# Altium project LM-004-A.PrjPcb
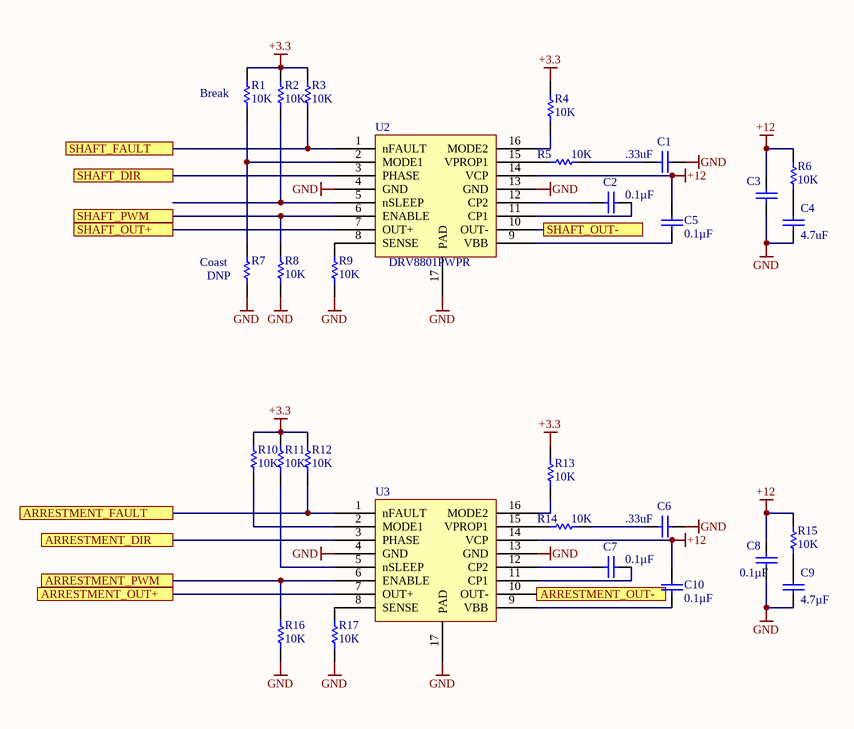
[diagram p0: DC-Motor-DRV.SchDoc]
4 sheets, 50 parts. Net scope: flat (ports and power ports of the same name join across sheets).
Board file: LM-004-B.PcbDoc
Sheets:
  DC-Motor-DRV.SchDoc
  Encoder.SchDoc
  BBB_Connections.SchDoc
  Bluetooth.SchDoc

## Sheet DC-Motor-DRV.SchDoc: DC Motor Driver
size OrCAD A; DocumentNumber: LM-004; Revision: B; SheetNumber: 1; SheetTotal: 4

### Parts
(Parts that share a designator on the sheet are numbered #1, #2 ... from top to bottom, then left to right.)
C1  .33uF  [CAPC0805(2012)145_N]
C2  Capacitance: 0.1µF  [CAPC0805(2012)145_N]  (hidden comment: 0.1uF)
C3  0.1uF  [CAPC0805(2012)145_N]  (value not drawn)
C4  4.7uF  [CAPC0805(2012)145_N]
C5  Capacitance: 0.1µF  [CAPC0805(2012)145_N]  (hidden comment: 0.1uF)
C6  .33uF  [CAPC0805(2012)145_N]
C7  Capacitance: 0.1µF  [CAPC0805(2012)145_N]  (hidden comment: CAP CER 0.1UF 25V X7R 0805)
C8  Capacitance: 0.1µF  [CAPC0805(2012)145_N]  (hidden comment: CAP CER 0.1UF 25V X7R 0805)
C9  Capacitance: 4.7µF  [CAPC0805(2012)145_N]  (hidden comment: CAP CER 0.1UF 25V X7R 0805)
C10  Capacitance: 0.1µF  [CAPC0805(2012)145_N]  (hidden comment: CAP CER 0.1UF 25V X7R 0805)
R1#1  10K  [RESC0805(2012)_L]
R2#1  10K  [RESC0805(2012)_L]
R3#1  10K  [RESC0805(2012)_L]
R4#1  10K  [RESC0805(2012)_L]
R5#1  10K  [RESC0805(2012)_L]
R6#1  10K  [RESC0805(2012)_L]
R7  DNP  [RESC0805(2012)_L]
R8  10K  [RESC0805(2012)_L]
R9  10K  [RESC0805(2012)_L]
R10  10K  [RESC0805(2012)_L]
R11  10K  [RESC0805(2012)_L]
R12  10K  [RESC0805(2012)_L]
R13  10K  [RESC0805(2012)_L]
R14  10K  [RESC0805(2012)_L]
R15  10K  [RESC0805(2012)_L]
R16  10K  [RESC0805(2012)_L]
R17  10K  [RESC0805(2012)_L]
U2  DRV8801PWPR  [DRV8801PWPR]
U3  DRV8801PWPR  [DRV8801PWPR]  (value not drawn)

### Ports
ARRESTMENT_DIR, ARRESTMENT_FAULT, ARRESTMENT_OUT+, ARRESTMENT_OUT-, ARRESTMENT_PWM, SHAFT_DIR, SHAFT_FAULT, SHAFT_OUT+, SHAFT_OUT-, SHAFT_PWM

### Nets
+3.3: R1#1.1 R2#1.1 R3#1.1 R4#1.1 R10.1 R11.1 R12.1 R13.1
+12: C3.1 C5.2 C8.1 C10.2 R6#1.1 R15.1 U2.14(VCP) U3.14(VCP)
GND: C1.1 C3.2 C4.2 C6.1 C8.2 C9.2 R7.2 R8.2 R9.2 R16.2 R17.2 U2.4(GND) U2.13(GND) U2.17(PAD) U3.4(GND) U3.13(GND) U3.17(PAD)
NetC1_2: C1.2 R5#1.1
NetC2_1: C2.1 U2.12(CP2)
NetC2_2: C2.2 U2.11(CP1)
NetC4_1: C4.1 R6#1.2
NetC5_1: C5.1 U2.9(VBB)
NetC6_2: C6.2 R14.1
NetC7_1: C7.1 U3.12(CP2)
NetC7_2: C7.2 U3.11(CP1)
NetC9_1: C9.1 R15.2
NetC10_1: C10.1 U3.9(VBB)
NetR1#1_2: R1#1.2 R7.1 U2.2(MODE1)
NetR2#1_2: R2#1.2 U2.5(nSLEEP)
NetR3#1_2: R3#1.2 U2.1(nFAULT) ; port SHAFT_FAULT
NetR4#1_2: R4#1.2 U2.16(MODE2)
NetR5#1_2: R5#1.2 U2.15(VPROP1)
NetR8_1: R8.1 U2.6(ENABLE) ; port SHAFT_PWM
NetR9_1: R9.1 U2.8(SENSE)
NetR10_2: R10.2 U3.2(MODE1)
NetR11_2: R11.2 U3.5(nSLEEP)
NetR12_2: R12.2 U3.1(nFAULT) ; port ARRESTMENT_FAULT
NetR13_2: R13.2 U3.16(MODE2)
NetR14_2: R14.2 U3.15(VPROP1)
NetR16_1: R16.1 U3.6(ENABLE) ; port ARRESTMENT_PWM
NetR17_1: R17.1 U3.8(SENSE)
NetU1_8-11: U2.3(PHASE) ; port SHAFT_DIR
NetU1_8-17: U3.3(PHASE) ; port ARRESTMENT_DIR
NetU2_7: U2.7(OUT+) ; port SHAFT_OUT+
NetU2_10: U2.10(OUT-) ; port SHAFT_OUT-
NetU3_7: U3.7(OUT+) ; port ARRESTMENT_OUT+
NetU3_10: U3.10(OUT-) ; port ARRESTMENT_OUT-

### Notes on the sheet
- (near R1#1) Break
- (near R7) Coast
- Title
- Size:
- Date:
- Orcad A
- Number:
- Time:
- Revision:
- Sheet
- of
- ZLS Corporation
- 7801 North Lamar Blvd.
- Suite E-184
- Austin, Texas 78752  USA
- (512) 453-0288
- File:

### Library data of the parts
C1 C6 = CMP-1036-04795-1: CAP CER 0.1UF 25V X7R 0805; Manufacturer: Wurth Electronics Inc.; Manufacturer Part Number: 885012207069; Tolerance: ±10%; Notification: Current market demand for these product types have resulted in fluctuating and extending lead times. Lead times may differ.; Supplier 1: Digi-Key; Supplier Part Number 1: 732-8058-6-ND; RoHS: RoHS Compliant; Category: Capacitors; Stock 1: 1331; Pricing 1: 1=0.1, 10=0.04, 100=0.0359, 500=0.0318 (USD); Packaging: Digi-Reel®; Part Status: Active; Voltage - Rated: 25V; Temperature Coefficient: X7R; Operating Temperature: -55°C ~ 125°C; Features: -; Ratings: -; Applications: General Purpose; Mounting Type: Surface Mount, MLCC; Package / Case: 0805 (2012 Metric); Size / Dimension: 0.079" L x 0.049" W (2.00mm x 1.25mm); Height - Seated (Max): -; Thickness (Max): 0.035" (0.90mm); Lead Spacing: -; Lead Style: -; ComponentLink1URL: https://katalog.we-online.de/pbs/datasheet/885012207069.pdf; ComponentLink1Description: https://katalog.we-online.de/pbs/datasheet/885012207069.pdf
C2 C5 = CMP-1036-04795-1: CAP CER 0.1UF 25V X7R 0805; Manufacturer: Murata Electronics North America; Manufacturer Part Number: GRM21BR71E104KA01L; Tolerance: ±10%; Supplier 1: Digi-Key; Supplier Part Number 1: 490-1673-6-ND; RoHS: RoHS Compliant; Category: Capacitors; Stock 1: 891652; Pricing 1: 1=0.2, 10=0.145, 100=0.0683, 500=0.04788, 1000=0.03964 (USD); Packaging: Digi-Reel®; Part Status: Active; Voltage - Rated: 25V; Temperature Coefficient: X7R; Operating Temperature: -55°C ~ 125°C; Features: -; Ratings: -; Applications: General Purpose; Mounting Type: Surface Mount, MLCC; Package / Case: 0805 (2012 Metric); Size / Dimension: 0.079" L x 0.049" W (2.00mm x 1.25mm); Height - Seated (Max): -; Thickness (Max): 0.053" (1.35mm); Lead Spacing: -; Lead Style: -; ComponentLink1URL: http://www.murata.com/~/media/webrenewal/support/library/catalog/products/capacitor/mlcc/c02e.ashx; ComponentLink1Description: http://www.murata.com/~/media/webrenewal/support/library/catalog/products/capacitor/mlcc/c02e.ashx
C3 = CMP-1036-04795-1: CAP CER 0.1UF 25V X7R 0805; Manufacturer: Murata Electronics North America; Manufacturer Part Number: GRM21BR71E104KA01L; Capacitance: 0.1µF; Tolerance: ±10%; Supplier 1: Digi-Key; Supplier Part Number 1: 490-1673-6-ND; RoHS: RoHS Compliant; Category: Capacitors; Stock 1: 891652; Pricing 1: 1=0.2, 10=0.145, 100=0.0683, 500=0.04788, 1000=0.03964 (USD); Packaging: Digi-Reel®; Part Status: Active; Voltage - Rated: 25V; Temperature Coefficient: X7R; Operating Temperature: -55°C ~ 125°C; Features: -; Ratings: -; Applications: General Purpose; Mounting Type: Surface Mount, MLCC; Package / Case: 0805 (2012 Metric); Size / Dimension: 0.079" L x 0.049" W (2.00mm x 1.25mm); Height - Seated (Max): -; Thickness (Max): 0.053" (1.35mm); Lead Spacing: -; Lead Style: -; ComponentLink1URL: http://www.murata.com/~/media/webrenewal/support/library/catalog/products/capacitor/mlcc/c02e.ashx; ComponentLink1Description: http://www.murata.com/~/media/webrenewal/support/library/catalog/products/capacitor/mlcc/c02e.ashx
C4 = CMP-1036-04795-1: CAP CER 4.7UF 25V 10% X7R 0805; Manufacturer: Murata Electronics North America; Manufacturer Part Number: GRM21BR71E104KA01L; Capacitance: 4.7µF; Supplier 1: Digi-Key; Supplier Part Number 1: 490-1673-6-ND; RoHS: RoHS Compliant; Category: Capacitors; Stock 1: 891652; Pricing 1: 1=0.2, 10=0.145, 100=0.0683, 500=0.04788, 1000=0.03964 (USD); Packaging: Digi-Reel®; Part Status: Active; Tolerance: ±10%; Voltage - Rated: 25V; Temperature Coefficient: X7R; Operating Temperature: -55°C ~ 125°C; Features: -; Ratings: -; Applications: General Purpose; Mounting Type: Surface Mount, MLCC; Package / Case: 0805 (2012 Metric); Size / Dimension: 0.079" L x 0.049" W (2.00mm x 1.25mm); Height - Seated (Max): -; Thickness (Max): 0.053" (1.35mm); Lead Spacing: -; Lead Style: -; ComponentLink1URL: http://www.murata.com/~/media/webrenewal/support/library/catalog/products/capacitor/mlcc/c02e.ashx; ComponentLink1Description: http://www.murata.com/~/media/webrenewal/support/library/catalog/products/capacitor/mlcc/c02e.ashx
C7 C8 C10 = CMP-1036-04795-1: Manufacturer: Murata Electronics North America; Manufacturer Part Number: GRM21BR71E104KA01L; Tolerance: ±10%; Supplier 1: Digi-Key; Supplier Part Number 1: 490-1673-6-ND; RoHS: RoHS Compliant; Category: Capacitors; Stock 1: 891652; Pricing 1: 1=0.2, 10=0.145, 100=0.0683, 500=0.04788, 1000=0.03964 (USD); Packaging: Digi-Reel®; Part Status: Active; Voltage - Rated: 25V; Temperature Coefficient: X7R; Operating Temperature: -55°C ~ 125°C; Features: -; Ratings: -; Applications: General Purpose; Mounting Type: Surface Mount, MLCC; Package / Case: 0805 (2012 Metric); Size / Dimension: 0.079" L x 0.049" W (2.00mm x 1.25mm); Height - Seated (Max): -; Thickness (Max): 0.053" (1.35mm); Lead Spacing: -; Lead Style: -; ComponentLink1URL: http://www.murata.com/~/media/webrenewal/support/library/catalog/products/capacitor/mlcc/c02e.ashx; ComponentLink1Description: http://www.murata.com/~/media/webrenewal/support/library/catalog/products/capacitor/mlcc/c02e.ashx
C9 = CMP-1036-04795-1: CAP CER 0.47UF 25V X7R 0805; Manufacturer: Murata Electronics North America; Manufacturer Part Number: GRM21BR71E104KA01L; Tolerance: ±10%; Supplier 1: Digi-Key; Supplier Part Number 1: 490-1673-6-ND; RoHS: RoHS Compliant; Category: Capacitors; Stock 1: 891652; Pricing 1: 1=0.2, 10=0.145, 100=0.0683, 500=0.04788, 1000=0.03964 (USD); Packaging: Digi-Reel®; Part Status: Active; Voltage - Rated: 25V; Temperature Coefficient: X7R; Operating Temperature: -55°C ~ 125°C; Features: -; Ratings: -; Applications: General Purpose; Mounting Type: Surface Mount, MLCC; Package / Case: 0805 (2012 Metric); Size / Dimension: 0.079" L x 0.049" W (2.00mm x 1.25mm); Height - Seated (Max): -; Thickness (Max): 0.053" (1.35mm); Lead Spacing: -; Lead Style: -; ComponentLink1URL: http://www.murata.com/~/media/webrenewal/support/library/catalog/products/capacitor/mlcc/c02e.ashx; ComponentLink1Description: http://www.murata.com/~/media/webrenewal/support/library/catalog/products/capacitor/mlcc/c02e.ashx
R1#1 R2#1 R3#1 R4#1 R5#1 R7-R14 R16 R17 = CMP-1013-00215-1: RES SMD 10K OHM 1% 1/8W 0805; Manufacturer: Vishay Dale; Manufacturer Part Number: CRCW080510K0FKEA; Power (Watts): 0.125W, 1/8W; Temperature Coefficient: ±100ppm/°C; Supplier 1: Digi-Key; Supplier Part Number 1: 541-10.0KCCT-ND; RoHS: RoHS Compliant; Category: Resistors; Stock 1: 1104982; Pricing 1: 1=0.1, 10=0.055, 100=0.0223, 1000=0.01003, 2500=0.0087 (USD); Packaging: Cut Tape (CT); Part Status: Active; Tolerance: ±1%; Composition: Thick Film; Features: Automotive AEC-Q200; Operating Temperature: -55°C ~ 155°C; Package / Case: 0805 (2012 Metric); Supplier Device Package: 0805; Size / Dimension: 0.079" L x 0.049" W (2.00mm x 1.25mm); Height - Seated (Max): 0.020" (0.50mm); Failure Rate: -; ComponentLink1URL: http://www.vishay.com/docs/20035/dcrcwe3.pdf; ComponentLink1Description: http://www.vishay.com/docs/20035/dcrcwe3.pdf
R6#1 R15 = CMP-1013-00215-1: RES SMD 1R OHM 1% 1/8W 0805; Manufacturer: Vishay Dale; Manufacturer Part Number: CRCW080510K0FKEA; Power (Watts): 0.125W, 1/8W; Temperature Coefficient: ±100ppm/°C; Supplier 1: Digi-Key; Supplier Part Number 1: 541-10.0KCCT-ND; RoHS: RoHS Compliant; Category: Resistors; Stock 1: 1104982; Pricing 1: 1=0.1, 10=0.055, 100=0.0223, 1000=0.01003, 2500=0.0087 (USD); Packaging: Cut Tape (CT); Part Status: Active; Tolerance: ±1%; Composition: Thick Film; Features: Automotive AEC-Q200; Operating Temperature: -55°C ~ 155°C; Package / Case: 0805 (2012 Metric); Supplier Device Package: 0805; Size / Dimension: 0.079" L x 0.049" W (2.00mm x 1.25mm); Height - Seated (Max): 0.020" (0.50mm); Failure Rate: -; ComponentLink1URL: http://www.vishay.com/docs/20035/dcrcwe3.pdf; ComponentLink1Description: http://www.vishay.com/docs/20035/dcrcwe3.pdf
U2 U3 = DRV8801PWPR: IC MOTOR DRIVER PAR 16HTSSOP; Manufacturer: Texas Instruments; Motor Type - Stepper: Bipolar; Motor Type - AC, DC: Brushed DC; Function: Driver - Fully Integrated, Control and Power Stage; Output Configuration: Half Bridge (2); Interface: Parallel; Current - Output: 2.8A; Voltage - Supply: 8 V ~ 38 V; Supplier 1: Digi-Key; Supplier Part Number 1: 296-25378-1-ND; Manufacturer Part Number: DRV8801PWPR; RoHS: RoHS Compliant; Category: Integrated Circuits (ICs); Stock 1: 44037; Pricing 1: 1=2.11, 10=1.892, 100=1.5204, 500=1.24914, 1000=1.035 (USD); Packaging: Cut Tape (CT); Part Status: Active; Technology: DMOS; Step Resolution: -; Applications: General Purpose; Voltage - Load: 8 V ~ 38 V; Operating Temperature: -40°C ~ 150°C (TJ); Mounting Type: Surface Mount; Package / Case: 16-TSSOP (0.173", 4.40mm Width) Exposed Pad; Supplier Device Package: 16-HTSSOP; Base Part Number: DRV8801; ComponentLink1URL: http://www.ti.com/lit/ds/symlink/drv8801.pdf; ComponentLink1Description: http://www.ti.com/lit/ds/symlink/drv8801.pdf

## Sheet Encoder.SchDoc: Encoder
size OrCAD A; DocumentNumber: LM-004; Revision: B; SheetNumber: 2; SheetTotal: 4
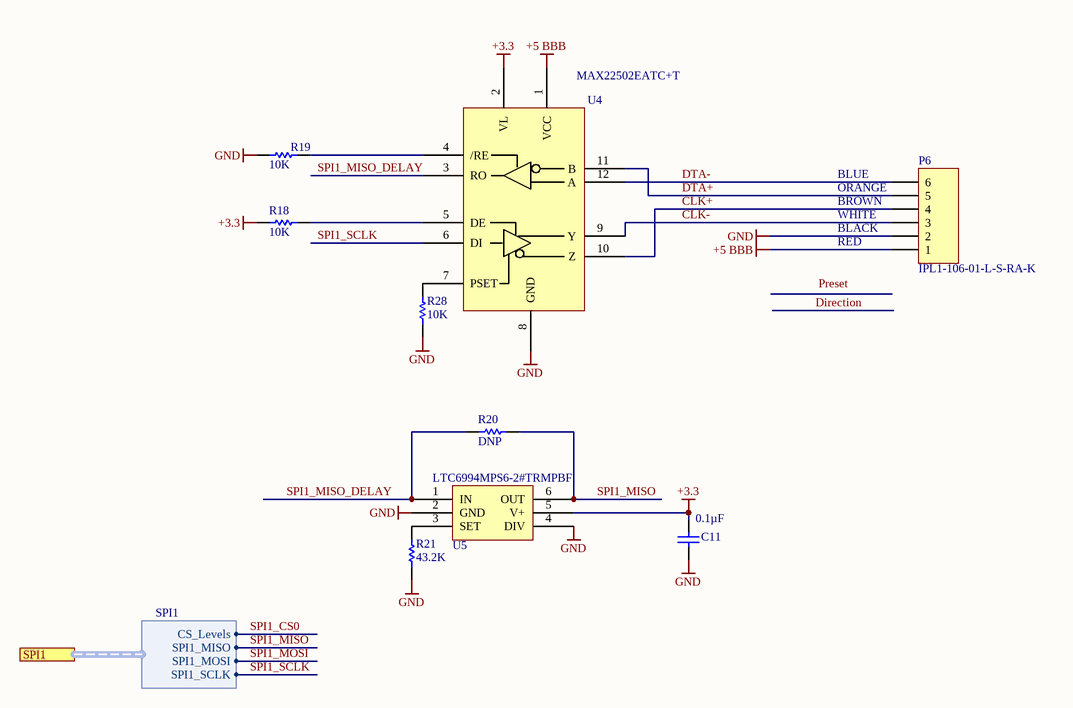
[diagram p1: Encoder.SchDoc]

### Parts
C11  Capacitance: 0.1µF  [CAPC0805(2012)145_N]  (hidden comment: CAP CER 0.1UF 25V X7R 0805)
P6  IPL1-106-01-L-S-RA-K  [IPL1-106-01-L-S-RA-K]
R18  10K  [RESC0805(2012)_L]
R19  10K  [RESC0805(2012)_L]
R20  DNP  [RESC0805(2012)_L]
R21  43.2K  [RESC0805(2012)_L]
R28  10K  [RESC0805(2012)_L]
U4  MAX22502EATC+T  [MAX22502EATC+T]
U5  LTC6994MPS6-2#TRMPBF  [LTC6994MPS6-2#TRMPBF]

### Ports
SPI1 (harness SPI1)

### Harnesses
SPI1: CS_Levels, SPI1_MISO, SPI1_MOSI, SPI1_SCLK

### Nets
+3.3: C11.1 R18.2 U4.2(VL) U5.5(V+)
+5 BBB: P6.1 U4.1(VCC)
GND: C11.2 P6.2 R19.2 R21.2 R28.2 U4.8(GND) U5.2(GND) U5.4(DIV)
CLK+: P6.4 U4.10(Z)
CLK-: P6.3 U4.9(Y)
DTA+: P6.5 U4.11(B)
DTA-: P6.6 U4.12(A)
SPI1_MISO: R20.2 U5.6(OUT) ; port SPI1.SPI1_MISO
SPI1_MISO_DELAY: R20.1 U4.3(RO) U5.1(IN)
SPI1_SCLK: U4.6(DI) ; port SPI1.SPI1_SCLK
NetR18_1: R18.1 U4.5(DE)
NetR19_1: R19.1 U4.4(/RE)
NetR21_1: R21.1 U5.3(SET)
NetR28_1: R28.1 U4.7(PSET)

### Notes on the sheet
- (near P6) BROWN
- (near P6) WHITE
- (near P6) ORANGE
- BLUE
- RED
- (near P6) BLACK
- Labels drawn without touching a wire or pin: Preset
- Title
- Size:
- Date:
- Orcad A
- Number:
- Time:
- Revision:
- Sheet
- of
- ZLS Corporation
- 7801 North Lamar Blvd.
- Suite E-184
- Austin, Texas 78752  USA
- (512) 453-0288
- File:

### Library data of the parts
C11 = CMP-1036-04795-1: as C7 on sheet DC-Motor-DRV; Supplier 1: Digi-Key; Supplier Part Number 1: 490-1673-6-ND; RoHS: RoHS Compliant; Category: Capacitors; Stock 1: 891652; Pricing 1: 1=0.2, 10=0.145, 100=0.0683, 500=0.04788, 1000=0.03964 (USD); Packaging: Digi-Reel®; Part Status: Active; Voltage - Rated: 25V; Temperature Coefficient: X7R; Operating Temperature: -55°C ~ 125°C; Features: -; Ratings: -; Applications: General Purpose; Mounting Type: Surface Mount, MLCC; Package / Case: 0805 (2012 Metric); Size / Dimension: 0.079" L x 0.049" W (2.00mm x 1.25mm); Height - Seated (Max): -; Thickness (Max): 0.053" (1.35mm); Lead Spacing: -; Lead Style: -; ComponentLink1URL: http://www.murata.com/~/media/webrenewal/support/library/catalog/products/capacitor/mlcc/c02e.ashx; ComponentLink1Description: http://www.murata.com/~/media/webrenewal/support/library/catalog/products/capacitor/mlcc/c02e.ashx
P6 = Header 6: Header, 6-Pin; Manufacturer: Samtec Inc.; Pitch - Mating: 0.100" (2.54mm); Number of Positions: 6; Number of Positions Loaded: All; Style: Board to Cable/Wire; Shrouding: Shrouded - 4 Wall; Contact Length - Mating: 0.215" (5.46mm); Contact Length - Post: 0.085" (2.16mm); Material Flammability Rating: UL94 V-0; Voltage Rating: 675VAC, 954VDC; Supplier 1: Digi-Key; Supplier Part Number 1: SAM9602-ND; Manufacturer Part Number: IPL1-106-01-L-S-RA-K; RoHS: RoHS Compliant; Category: Connectors, Interconnects; Stock 1: 6; Pricing 1: 1=2.73, 34=2.39794, 102=2.18, 510=1.853, 1020=1.5805, 5032=1.417 (USD); Packaging: Tube; Part Status: Active; Connector Type: Header; Contact Type: Male Pin; Number of Rows: 1; Row Spacing - Mating: -; Mounting Type: Through Hole, Right Angle; Termination: Solder; Fastening Type: Locking Ramp; Overall Contact Length: -; Insulation Height: 0.240" (6.10mm); Contact Shape: Square; Contact Finish - Mating: Gold; Contact Finish Thickness - Mating: 10.0µin (0.25µm); Contact Finish - Post: Tin; Contact Material: Phosphor Bronze; Insulation Material: Liquid Crystal Polymer (LCP); Features: -; Operating Temperature: -55°C ~ 125°C; Ingress Protection: -; Insulation Color: Natural; Current Rating: -; Mated Stacking Heights: -; Contact Finish Thickness - Post: -; Applications: -; ComponentLink1URL: http://suddendocs.samtec.com/prints/ipl1-1xx-xx-xxx-s-xx-x-xx-mkt.pdf; ComponentLink1Description: http://suddendocs.samtec.com/prints/ipl1-1xx-xx-xxx-s-xx-x-xx-mkt.pdf
R18 R19 R28 = CMP-1013-00215-1: as R1#1 on sheet DC-Motor-DRV; Supplier 1: Digi-Key; Supplier Part Number 1: 541-10.0KCCT-ND; RoHS: RoHS Compliant; Category: Resistors; Stock 1: 1104982; Pricing 1: 1=0.1, 10=0.055, 100=0.0223, 1000=0.01003, 2500=0.0087 (USD); Packaging: Cut Tape (CT); Part Status: Active; Tolerance: ±1%; Composition: Thick Film; Features: Automotive AEC-Q200; Operating Temperature: -55°C ~ 155°C; Package / Case: 0805 (2012 Metric); Supplier Device Package: 0805; Size / Dimension: 0.079" L x 0.049" W (2.00mm x 1.25mm); Height - Seated (Max): 0.020" (0.50mm); Failure Rate: -; ComponentLink1URL: http://www.vishay.com/docs/20035/dcrcwe3.pdf; ComponentLink1Description: http://www.vishay.com/docs/20035/dcrcwe3.pdf
R20 = CMP-1013-00215-1: RES SMD 0 OHM 5% 1/8W 0805
R21 = CMP-1013-00215-1: RES SMD 43.2K OHM 1% 1/8W 0805; Manufacturer: Vishay Dale; Manufacturer Part Number: CRCW080543K2FKEA; Power (Watts): 0.125W, 1/8W; Temperature Coefficient: ±100ppm/°C; Supplier 1: Digi-Key; Supplier Part Number 1: 541-43.2KCCT-ND; RoHS: RoHS Compliant; Category: Resistors; Stock 1: 68577; Pricing 1: 1=0.1, 10=0.055, 100=0.0223, 1000=0.01003, 2500=0.0087 (USD); Packaging: Cut Tape (CT); Part Status: Active; Tolerance: ±1%; Composition: Thick Film; Features: Automotive AEC-Q200; Operating Temperature: -55°C ~ 155°C; Package / Case: 0805 (2012 Metric); Supplier Device Package: 0805; Size / Dimension: 0.079" L x 0.049" W (2.00mm x 1.25mm); Height - Seated (Max): 0.020" (0.50mm); Failure Rate: -; ComponentLink1URL: http://www.vishay.com/docs/20035/dcrcwe3.pdf; ComponentLink1Description: http://www.vishay.com/docs/20035/dcrcwe3.pdf
U5 = LTC6994MPS6-2#TRMPBF: Manufacturer: Linear Technology/Analog Devices; Manufacturer Part Number: LTC6994CS6-2#TRMPBF; Function: Programmable; Available Total Delays: 1µs ~ 33.6s; Voltage - Supply: 2.25 V ~ 5.5 V; Supplier 1: Digi-Key; Supplier Part Number 1: LTC6994CS6-2#TRMPBFCT-ND; RoHS: RoHS Compliant; Category: Integrated Circuits (ICs); Stock 1: 1401; Pricing 1: 1=3.42, 25=3.0496, 100=1.9217, 250=1.76156 (USD); Packaging: Cut Tape (CT); Part Status: Active; Delay to 1st Tap: -; Operating Temperature: 0°C ~ 70°C; Mounting Type: Surface Mount; Package / Case: SOT-23-6 Thin, TSOT-23-6; Supplier Device Package: TSOT-23-6; Base Part Number: LTC6994; ComponentLink1URL: http://www.linear.com/docs/29725; ComponentLink1Description: http://www.linear.com/docs/29725

## Sheet BBB_Connections.SchDoc: BBB Connections
size Tabloid; DocumentNumber: LM-004; Revision: C; SheetNumber: 3; SheetTotal: 4
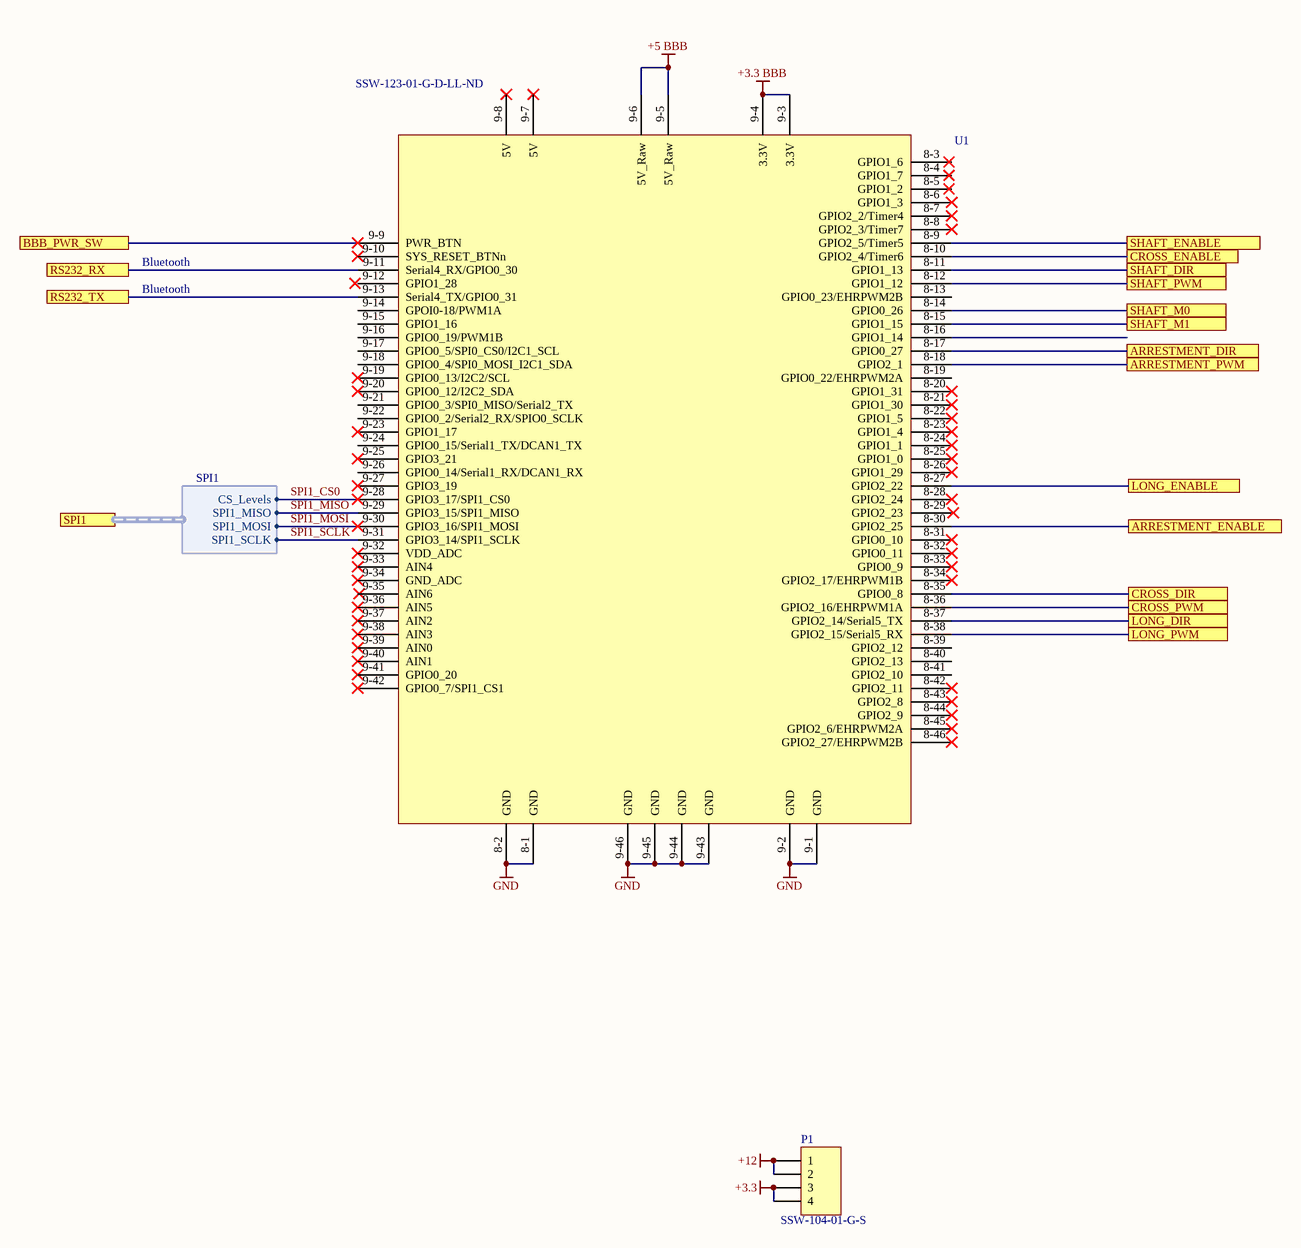
[diagram p2: BBB_Connections.SchDoc]

### Parts
P1  SSW-104-01-G-S  [HDR1X4]
U1  Supplier Part Number 1: SSW-123-01-G-D-LL-ND  [Beaglebone Black Mezanine]  (hidden comment: BBB)

### Ports
ARRESTMENT_DIR, ARRESTMENT_ENABLE, ARRESTMENT_PWM, BBB_PWR_SW, CROSS_DIR, CROSS_ENABLE, CROSS_PWM, LONG_DIR, LONG_ENABLE, LONG_PWM, RS232_RX, RS232_TX, SHAFT_DIR, SHAFT_ENABLE, SHAFT_M0, SHAFT_M1, SHAFT_PWM, SPI1 (harness SPI1)

### Harnesses
SPI1: CS_Levels, SPI1_MISO, SPI1_MOSI, SPI1_SCLK

### Nets
+3.3: P1.3 P1.4
+3.3 BBB: U1.9-3(3.3V) U1.9-4(3.3V)
+5 BBB: U1.9-5(5V_Raw) U1.9-6(5V_Raw)
+12: P1.1 P1.2
GND: U1.8-1(GND) U1.8-2(GND) U1.9-1(GND) U1.9-2(GND) U1.9-43(GND) U1.9-44(GND) U1.9-45(GND) U1.9-46(GND)
RS232_RX: U1.9-11(Serial4_RX/GPIO0_30) ; port RS232_RX
RS232_TX: U1.9-13(Serial4_TX/GPIO0_31) ; port RS232_TX
SPI1_CS0: U1.9-28(GPIO3_17/SPI1_CS0) ; port SPI1.CS_Levels
SPI1_MISO: U1.9-29(GPIO3_15/SPI1_MISO) ; port SPI1.SPI1_MISO
SPI1_MOSI: U1.9-30(GPIO3_16/SPI1_MOSI) ; port SPI1.SPI1_MOSI
SPI1_SCLK: U1.9-31(GPIO3_14/SPI1_SCLK) ; port SPI1.SPI1_SCLK
NetR8_1: U1.8-12(GPIO1_12) ; port SHAFT_PWM
NetR16_1: U1.8-18(GPIO2_1) ; port ARRESTMENT_PWM
NetU1_8-9: U1.8-9(GPIO2_5/Timer5) ; port SHAFT_ENABLE
NetU1_8-10: U1.8-10(GPIO2_4/Timer6) ; port CROSS_ENABLE
NetU1_8-11: U1.8-11(GPIO1_13) ; port SHAFT_DIR
NetU1_8-14: U1.8-14(GPIO0_26) ; port SHAFT_M0
NetU1_8-15: U1.8-15(GPIO1_15) ; port SHAFT_M1
NetU1_8-17: U1.8-17(GPIO0_27) ; port ARRESTMENT_DIR
NetU1_8-27: U1.8-27(GPIO2_22) ; port LONG_ENABLE
NetU1_8-30: U1.8-30(GPIO2_25) ; port ARRESTMENT_ENABLE
NetU1_8-35: U1.8-35(GPIO0_8) ; port CROSS_DIR
NetU1_8-36: U1.8-36(GPIO2_16/EHRPWM1A) ; port CROSS_PWM
NetU1_8-37: U1.8-37(GPIO2_14/Serial5_TX) ; port LONG_DIR
NetU1_8-38: U1.8-38(GPIO2_15/Serial5_RX) ; port LONG_PWM
NetU1_9-9: U1.9-9(PWR_BTN) ; port BBB_PWR_SW

Not connected (* = marked no-connect by the designer): U1 8-3(GPIO1_6) 8-4(GPIO1_7) 8-5(GPIO1_2) 8-6(GPIO1_3)* 8-7(GPIO2_2/Timer4)* 8-8(GPIO2_3/Timer7)* 8-13(GPIO0_23/EHRPWM2B) 8-16(GPIO1_14) 8-19(GPIO0_22/EHRPWM2A) 8-20(GPIO1_31)* 8-21(GPIO1_30)* 8-22(GPIO1_5)* 8-23(GPIO1_4)* 8-24(GPIO1_1)* 8-25(GPIO1_0)* 8-26(GPIO1_29)* 8-28(GPIO2_24)* 8-29(GPIO2_23) 8-31(GPIO0_10)* 8-32(GPIO0_11)* 8-33(GPIO0_9)* 8-34(GPIO2_17/EHRPWM1B)* 8-39(GPIO2_12) 8-40(GPIO2_13) 8-41(GPIO2_10) 8-42(GPIO2_11)* 8-43(GPIO2_8)* 8-44(GPIO2_9)* 8-45(GPIO2_6/EHRPWM2A)* 8-46(GPIO2_27/EHRPWM2B)* 9-7(5V)* 9-8(5V)* 9-10(SYS_RESET_BTNn)* 9-12(GPIO1_28) 9-14(GPOI0-18/PWM1A) 9-15(GPIO1_16) 9-16(GPIO0_19/PWM1B) 9-17(GPIO0_5/SPI0_CS0/I2C1_SCL) 9-18(GPIO0_4/SPI0_MOSI_I2C1_SDA) 9-19(GPIO0_13/I2C2/SCL)* 9-20(GPIO0_12/I2C2_SDA)* 9-21(GPIO0_3/SPI0_MISO/Serial2_TX) 9-22(GPIO0_2/Serial2_RX/SPIO0_SCLK) 9-23(GPIO1_17)* 9-24(GPIO0_15/Serial1_TX/DCAN1_TX) 9-25(GPIO3_21)* 9-26(GPIO0_14/Serial1_RX/DCAN1_RX) 9-27(GPIO3_19)* 9-32(VDD_ADC)* 9-33(AIN4)* 9-34(GND_ADC)* 9-35(AIN6) 9-36(AIN5)* 9-37(AIN2)* 9-38(AIN3)* 9-39(AIN0)* 9-40(AIN1)* 9-41(GPIO0_20)* 9-42(GPIO0_7/SPI1_CS1)*

### Notes on the sheet
- Bluetooth
- Title
- Size:
- Date:
- Tabloid
- Number:
- Time:
- Revision:
- Sheet
- of
- ZLS Corporation
- 7801 North Lamar Blvd.
- Suite E-184
- Austin, Texas 78752  USA
- (512) 453-0288
- File:

### Library data of the parts
P1 = Header 4: Header, 4-Pin; Manufacturer: Samtec Inc.; Connector Type: Receptacle; Style: Board to Board or Cable; Number of Positions: 4; Number of Positions Loaded: All; Pitch - Mating: 0.100" (2.54mm); Contact Length - Post: 0.104" (2.64mm); Material Flammability Rating: UL94 V-0; Current Rating: 5.7A per Contact; Supplier 1: Digi-Key; Supplier Part Number 1: SAM1209-04-ND; Manufacturer Part Number: SSW-104-01-G-S; RoHS: RoHS Compliant; Category: Connectors, Interconnects; Stock 1: 360; Pricing 1: 1=1.85, 10=1.654, 100=1.3623, 500=1.07684, 1000=0.9244, 5000=0.84331, 10000=0.81088 (USD); Packaging: Bulk; Part Status: Active; Contact Type: Forked; Row Spacing - Mating: -; Mounting Type: Through Hole; Termination: Solder; Fastening Type: Push-Pull; Contact Finish - Mating: Gold; Contact Finish Thickness - Mating: 20.0µin (0.51µm); Insulation Color: Black; Insulation Height: 0.335" (8.51mm); Operating Temperature: -55°C ~ 125°C; Contact Finish - Post: Gold; Mated Stacking Heights: -; Ingress Protection: -; Features: -; Voltage Rating: -; Applications: -; Insulation Material: Liquid Crystal Polymer (LCP); Contact Shape: Square; Contact Material: Phosphor Bronze; Contact Finish Thickness - Post: 3.00µin (0.076µm); ComponentLink1URL: http://suddendocs.samtec.com/prints/ssw-1xx-xx-xxx-x-xx-xxx-xx-mkt.pdf; ComponentLink1Description: http://suddendocs.samtec.com/prints/ssw-1xx-xx-xxx-x-xx-xxx-xx-mkt.pdf
U1 = Beaglebone_Black_Mezanine: Beaglebone Black; Manufacturer: Samtec Inc.; Manufacturer Part Number: SSW-123-01-G-D-LL; Connector Type: Receptacle; Style: Board to Board or Cable; Number of Positions: 46; Number of Positions Loaded: All; Pitch - Mating: 0.100" (2.54mm); Contact Length - Post: 0.104" (2.64mm); Material Flammability Rating: UL94 V-0; Current Rating: 5.7A per Contact; Supplier 1: Digi-Key; RoHS: RoHS Compliant; Category: Connectors, Interconnects; Stock 1: 0; Pricing 1: 1=6.07 (USD); Packaging: Bulk; Part Status: Active; Contact Type: Forked; Row Spacing - Mating: 0.100" (2.54mm); Mounting Type: Through Hole; Termination: Kinked Pin, Solder; Fastening Type: Push-Pull; Contact Finish - Mating: Gold; Contact Finish Thickness - Mating: 20.0µin (0.51µm); Insulation Color: Black; Insulation Height: 0.335" (8.51mm); Operating Temperature: -55°C ~ 125°C; Contact Finish - Post: Gold; Mated Stacking Heights: -; Ingress Protection: -; Features: -; Voltage Rating: -; Applications: -; Insulation Material: Liquid Crystal Polymer (LCP); Contact Shape: Square; Contact Material: Phosphor Bronze; Contact Finish Thickness - Post: 3.00µin (0.076µm)

## Sheet Bluetooth.SchDoc: Bluetooth
size OrCAD A; DocumentNumber: LM-004; Revision: C; SheetNumber: 4; SheetTotal: 4
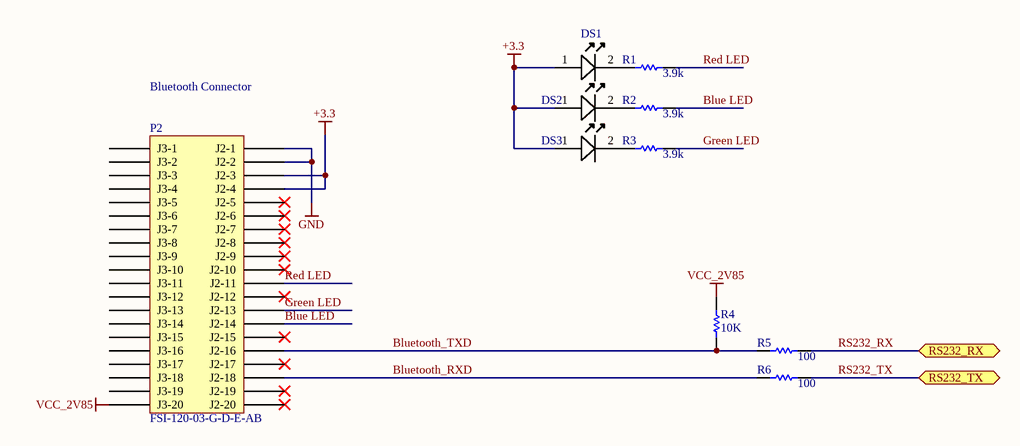
[diagram p3: Bluetooth.SchDoc]

### Parts
(Parts that share a designator on the sheet are numbered #1, #2 ... from top to bottom, then left to right.)
DS1  Lite-On LTST-S220KGKT Green LED, 571 nm 2012 (0805) Side View, Rectangle Lens SMD package  [0805C_L]  (value not drawn)
DS2  Lite-On LTST-S220KGKT Green LED, 571 nm 2012 (0805) Side View, Rectangle Lens SMD package  [0805C_L]  (value not drawn)
DS3  Lite-On LTST-S220KGKT Green LED, 571 nm 2012 (0805) Side View, Rectangle Lens SMD package  [0805C_L]  (value not drawn)
P2  FSI-120-03-G-D-E-AB  [FSI-120-03-G-D-E-AB]
R1#2  3.9k  [RESC0805(2012)_L]
R2#2  3.9k  [RESC0805(2012)_L]
R3#2  3.9k  [RESC0805(2012)_L]
R4#2  10K  [RESC0805(2012)_L]
R5#2  100  [RESC0805(2012)_L]
R6#2  100  [RESC0805(2012)_L]

### Ports
RS232_RX, RS232_TX

### Nets
+3.3: DS1.1(A) DS2.1(A) DS3.1(A) P2.J2-3 P2.J2-4
GND: P2.J2-1 P2.J2-2
VCC_2V85: P2.J3-20 R4#2.1
Blue LED: P2.J2-14 R2#2.1
Bluetooth_RXD: P2.J2-18 R6#2.2
Bluetooth_TXD: P2.J2-16 R4#2.2 R5#2.2
Green LED: P2.J2-13 R3#2.1
Red LED: P2.J2-11 R1#2.1
RS232_RX: R5#2.1 ; port RS232_RX
RS232_TX: R6#2.1 ; port RS232_TX
NetDS1_2: DS1.2(K) R1#2.2
NetDS2_2: DS2.2(K) R2#2.2
NetDS3_2: DS3.2(K) R3#2.2

Not connected (* = marked no-connect by the designer): P2 J2-5* J2-6* J2-7* J2-8* J2-9* J2-10* J2-12* J2-15* J2-17* J2-19* J2-20* J3-1 J3-2 J3-3 J3-4 J3-5 J3-6 J3-7 J3-8 J3-9 J3-10 J3-11 J3-12 J3-13 J3-14 J3-15 J3-16 J3-17 J3-18 J3-19

### Notes on the sheet
- Bluetooth Connector
- Title
- Size:
- Date:
- Orcad A
- Number:
- Time:
- Revision:
- Sheet
- of
- ZLS Corporation
- 7801 North Lamar Blvd.
- Suite E-184
- Austin, Texas 78752  USA
- (512) 453-0288
- File:

### Library data of the parts
DS1-DS3 = LED A/K: Manufacturer: Vishay / Lite-On; Lens Colour: Colorless; Viewing Angle: 130°; Luminous Intensity: 35mcd; Forward Current: 20mA; Forward Voltage: 2V; Lens Style: Diffused,Colorless; Power Rating: 75mW; Dominant Wavelength: 568nm; Lens Transparency: Clear; Number of Elements: 1; Power Dissipation: 75W; Wavelength: 574nm; Supplier 1: Digi-Key; Supplier Part Number 1: 160-1468-1-ND; Manufacturer Part Number: LTST-S220KGKT; Stock 1: 74800; Pricing 1: 1=0.29, 10=0.212, 25=0.1564, 100=0.1117, 250=0.0759, 500=0.067, 1000=0.0525 (USD); Mount: Surface Mount; Case/Package: 0805; Number of Pins: 2; Colour: Green; Case Code (Metric): 2012; Case Code (Imperial): 0805; Min Operating Temperature: -55°C; Max Operating Temperature: 85°C; Packaging: Tape and Reel; Package Quantity: 4000; Illumination Colour: Green; Test Current: 20mA; Number of LEDs: 1; Length: 2.1mm; Height: 0.6mm; Width: 1mm; Depth: 0.6mm; Radiation Hardening: No; Lead Free: Lead Free; ComponentLink1URL: https://datasheet.ciiva.com/11775/0900766b80dc0b70-11775441.pdf; ComponentLink1Description: https://datasheet.ciiva.com/11775/0900766b80dc0b70-11775441.pdf; ComponentLink2URL: https://datasheet.ciiva.com/2110/s-110-ltst-s220kgkt-2110069.pdf; ComponentLink2Description: https://datasheet.ciiva.com/2110/s-110-ltst-s220kgkt-2110069.pdf; ComponentLink3URL: https://datasheet.ciiva.com/2110/s-110-ltst-s220kgkt-2110070.pdf; ComponentLink3Description: https://datasheet.ciiva.com/2110/s-110-ltst-s220kgkt-2110070.pdf; ComponentLink4URL: https://datasheet.ciiva.com/12400/100-ltst-s220kgkt-59602-12400886.pdf; ComponentLink4Description: https://datasheet.ciiva.com/12400/100-ltst-s220kgkt-59602-12400886.pdf; ComponentLink5URL: https://datasheet.ciiva.com/2110/s-110-ltst-s220kgkt-2110071.pdf; ComponentLink5Description: https://datasheet.ciiva.com/2110/s-110-ltst-s220kgkt-2110071.pdf; ComponentLink6URL: https://datasheet.ciiva.com/16379/ltst-s220kgkt-16379082.pdf; ComponentLink6Description: https://datasheet.ciiva.com/16379/ltst-s220kgkt-16379082.pdf; Supplier 2: Farnell; Supplier Part Number 2: 2062310; RoHS: YES; Stock 2: 2271; Pricing 2: 1=0.325, 10=0.317, 100=0.23, 200=0.228, 400=0.182, 900=0.147, 3000=0.114, 9000=0.107 (GBP); ComponentLink7URL: http://www.farnell.com/cad/2124774.pdf; ComponentLink7Description: http://www.farnell.com/cad/2124774.pdf; ComponentLink8URL: http://www.farnell.com/datasheets/693084.pdf; ComponentLink8Description: http://www.farnell.com/datasheets/693084.pdf
R1#2 R2#2 R3#2 = CMP-1013-00215-1: 2R55 0.125W 1% 0805 (2012 Metric)  SMD; Case-Metric: 2012; Case-EIA: 0805; Value: 3.9k; Tolerance: 1 %; Technology: SMT; Power: 0.125 W
R4#2 R5#2 R6#2 = CMP-1013-00215-1: 2R55 0.125W 1% 0805 (2012 Metric)  SMD; Case-Metric: 2012; Value: 3.9k; Case-EIA: 0805; Tolerance: 1 %; Technology: SMT; Power: 0.125 W
P2 = FSI-120-03-G-D-E-AB: Supplier 1: Avnet; Supplier Part Number 1: FSI-120-03-G-D-E-AB

## Nets that join several sheets
+3.3: DC-Motor-DRV (8 pins), Encoder (C11.1 R18.2 U4.2 U5.5), BBB_Connections (P1.3 P1.4), Bluetooth (5 pins)
+5 BBB: Encoder (P6.1 U4.1), BBB_Connections (U1.9-5 U1.9-6)
+12: DC-Motor-DRV (8 pins), BBB_Connections (P1.1 P1.2)
GND: DC-Motor-DRV (17 pins), Encoder (8 pins), BBB_Connections (8 pins), Bluetooth (P2.J2-1 P2.J2-2)
NetR8_1: DC-Motor-DRV (R8.1 U2.6), BBB_Connections (U1.8-12)
NetR16_1: DC-Motor-DRV (R16.1 U3.6), BBB_Connections (U1.8-18)
NetU1_8-11: DC-Motor-DRV (U2.3), BBB_Connections (U1.8-11)
NetU1_8-17: DC-Motor-DRV (U3.3), BBB_Connections (U1.8-17)
RS232_RX: BBB_Connections (U1.9-11), Bluetooth (R5#2.1)
RS232_TX: BBB_Connections (U1.9-13), Bluetooth (R6#2.1)
SPI1_MISO: Encoder (R20.2 U5.6), BBB_Connections (U1.9-29)
SPI1_SCLK: Encoder (U4.6), BBB_Connections (U1.9-31)